# EAGLE design XBee-Explorer-DongleMini-v14 (EAGLE 6.2)
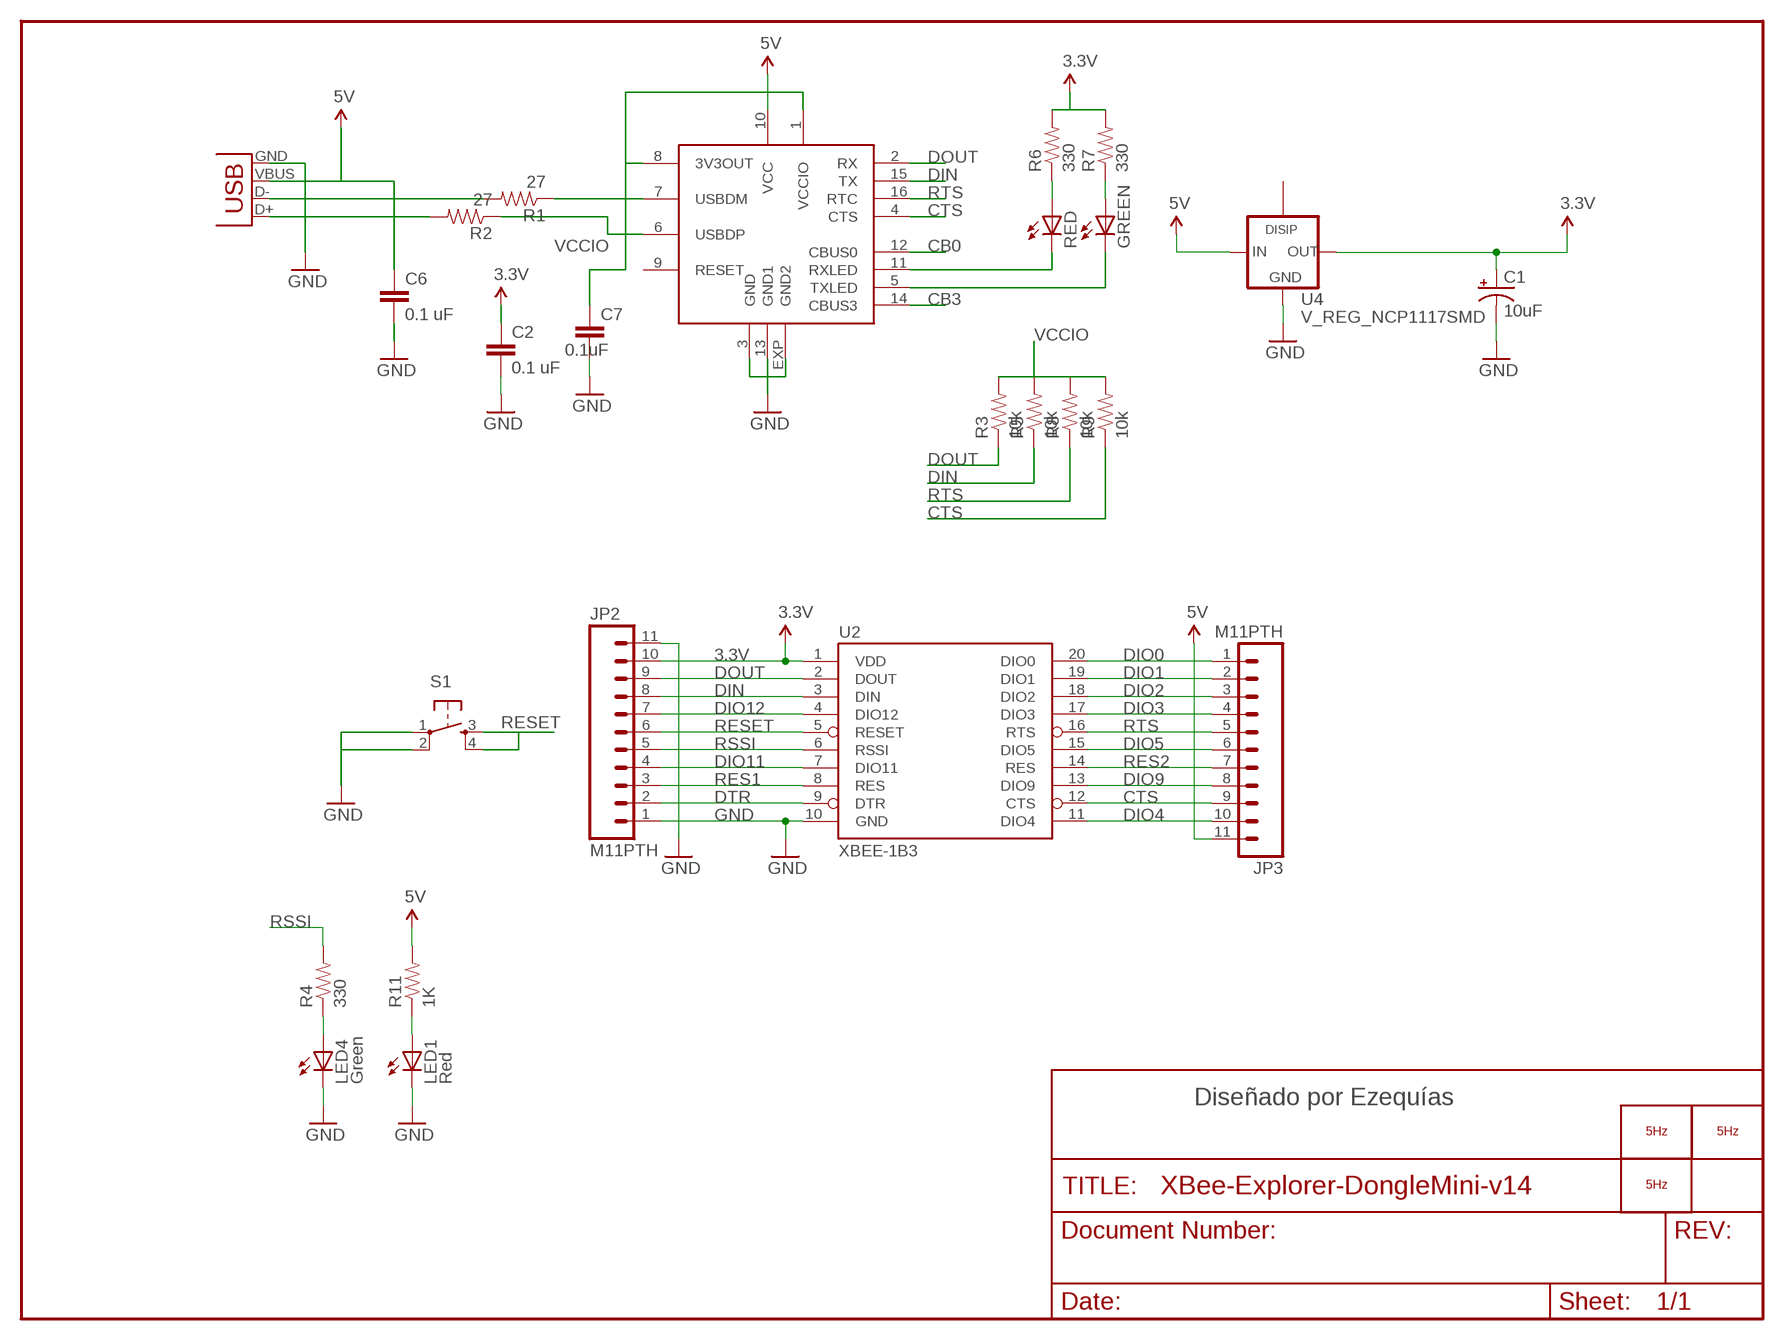
[diagram p0: schematic, sheet 1]

## Parts
C1  10uF  CAP_POL1206  [EIA3216]
C2  0.1 uF  CAP0603-CAP  [0603-CAP]
C6  0.1 uF  CAP0603-CAP  [0603-CAP]
C7  0.1uF  CAP0603-CAP  [0603-CAP]
GREEN  LED0603  [LED-0603]
JP2  M11PTH  [1X11]
JP3  M11PTH  [1X11]
LED1  Red  LED0603  [LED-0603]
LED4  Green  LED0603  [LED-0603]
LOGO2  LOGO_5HZ_H_10MM  [5HZ_LOGO_H_10MM]
LOGO3  LOGO_5HZ_H_COOPER_15MM  [5HZ_LOGO_H_COOPER_15MM]
LOGO4  LOGO_5HZ_WEB_COOPER_10MM  [5HZ_WEB_COOPER_10MM]
R1  27  RESISTOR0603-RES  [0603-RES]
R2  27  RESISTOR0603-RES  [0603-RES]
R3  10k  RESISTOR0603-RES  [0603-RES]
R4  330  RESISTOR0603-RES  [0603-RES]
R5  10k  RESISTOR0603-RES  [0603-RES]
R6  330  RESISTOR0603-RES  [0603-RES]
R7  330  RESISTOR0603-RES  [0603-RES]
R8  10k  RESISTOR0603-RES  [0603-RES]
R9  10k  RESISTOR0603-RES  [0603-RES]
R11  1K  RESISTOR0603-RES  [0603-RES]
RED  LED0603  [LED-0603]
S1  TAC_SWITCHSMD  [TACTILE_SWITCH_SMD]
U2  XBEE-1B3  [XBEE-SMD]
U4  V_REG_NCP1117SMD  [SOT223]
U$5  FT230  [QFN-16]
X1  USBSMD  [USB-MINIB]

## Nets
3.3V [vcc]: C1.A(+) C2.1 JP2.10 R6.2 R7.2 U2.1(VDD) U4.2(OUT)
5V [vcc]: C6.1 JP3.11 R11.2 U4.3(IN) U$5.10(VCC) X1.VBUS
CB0: U$5.12(CBUS0)
CB3: U$5.14(CBUS3)
CTS: JP3.9 R9.1 U2.12(CTS) U$5.4(CTS)
DIN: JP2.8 R5.1 U2.3(DIN) U$5.15(TX)
DIO0: JP3.1 U2.20(DIO0)
DIO1: JP3.2 U2.19(DIO1)
DIO2: JP3.3 U2.18(DIO2)
DIO3: JP3.4 U2.17(DIO3)
DIO4: JP3.10 U2.11(DIO4)
DIO5: JP3.6 U2.15(DIO5)
DIO9: JP3.8 U2.13(DIO9)
DIO11: JP2.4 U2.7(DIO11)
DIO12: JP2.7 U2.4(DIO12)
DOUT: JP2.9 R3.1 U2.2(DOUT) U$5.2(RX)
DTR: JP2.2 U2.9(DTR)
GND [vcc]: C1.C(-) C2.2 C6.2 C7.2 JP2.1 JP2.11 LED1.C LED4.C S1.1 S1.2 U2.10(GND) U4.1(GND) U$5.3(GND) U$5.13(GND1) U$5.EXP(GND2) X1.GND
N$1: R2.1 U$5.6(USBDP)
N$2: LED4.A R4.1
N$3: R1.1 U$5.7(USBDM)
N$5: R1.2 X1.D-
N$6: R2.2 X1.D+
N$8: GREEN.A R7.1
N$9: R6.1 RED.A
N$10: RED.C U$5.11(RXLED)
N$11: GREEN.C U$5.5(TXLED)
N$38: LED1.A R11.1
RES1: JP2.3 U2.8(RES)
RES2: JP3.7 U2.14(RES)
RESET: JP2.6 S1.3 S1.4 U2.5(RESET)
RSSI: JP2.5 R4.2 U2.6(RSSI)
RTS: JP3.5 R8.1 U2.16(RTS) U$5.16(RTC)
VCCIO: C7.1 R3.2 R5.2 R8.2 R9.2 U$5.1(VCCIO) U$5.8(3V3OUT)
Unconnected: U4.4 U$5.9(RESET)

## Notes on the sheet
- Diseñado por Ezequías

## Library data of the parts
C1 = SparkFun:CAP_POL: Capacitor Polarized These are standard SMD and PTH capacitors. Normally 10uF, 47uF, and 100uF in electrolytic and tantalum varieties. Always verify the external diameter of the through hole cap, it varies with capacity, voltage, and manufacturer. The EIA devices should be standard.
C2 C6 C7 = SparkFun:CAP: Capacitor Standard 0603 ceramic capacitor, and 0.1" leaded capacitor.
GREEN LED1 LED4 RED = SparkFun:LED: LEDs Standard schematic elements and footprints for 5mm, 3mm, 1206, and 0603 sized LEDs. 5mm - Spark Fun Electronics SKU : COM-00529 (and others)
JP2 JP3 = SparkFun:M11: Header 11 Standard 11-pin 0.1" header. Use with straight break away headers (SKU : PRT-00116), right angle break away headers (PRT-00553), swiss pins (PRT-00743), machine pins (PRT-00117), and female headers (PRT-00115).
LOGO2-LOGO4 = 5hz-electronica:LOGO_5HZ: Logotipo 5Hz "según Pedro"
R1-R9 R11 = SparkFun:RESISTOR: Resistor Basic schematic elements and footprints for 0603, 1206, and PTH resistors.
S1 = SparkFun:TAC_SWITCH: Momentary Switch Button commonly used for reset or general input. Spark Fun Electronics SKU : COM-00097
U2 = SparkFun:XBEE-1
U4 = 5hz-electronica:V_REG_NCP1117: Voltage Regulator The NCP1117 series are low dropout positive voltage regulators that are capable of providing an output current that is in excess of 1.0 A with a maximum dropout voltage of 1.2 V at 800 mA over temperature. This series contains eight fixed output voltages of 1.5 V, 1.8 V, 2.0 V, 2.5 V, 2.85 V, 3.3 V, 5.0 V, and 12 V that have no minimum load requirement to maintain regulation. Also included is an adjustable output version that can be programmed from 1.25 V to 18.8 V with two external resistors. On chip trimming adjusts the reference/output voltage to within ±1.0% accuracy. Internal protection features consist of output current limiting, safe operating area compensation, and thermal shutdown. The NCP1117 series can operate with up to 20 V input. Devices are available in SOT-223 and DPAK packages.
U$5 = FT230:FT230
X1 = SparkFun:USB: USB Connectors USB-B-PTH is fully proven SKU : PRT-00139 USB-miniB is fully proven SKU : PRT-00587 USB-A-PCB is untested. USB-A-H is throughly reviewed, but untested. Spark Fun Electronics SKU : PRT-00437 USB-B-SMT is throughly reviewed, but untested. Needs silkscreen touching up. USB-A-S has not been used/tested USB-MB-H has not been used/tested

## Net classes
1 vcc: width 0.254 mm
2 gnd: width 0.254 mm

## Board
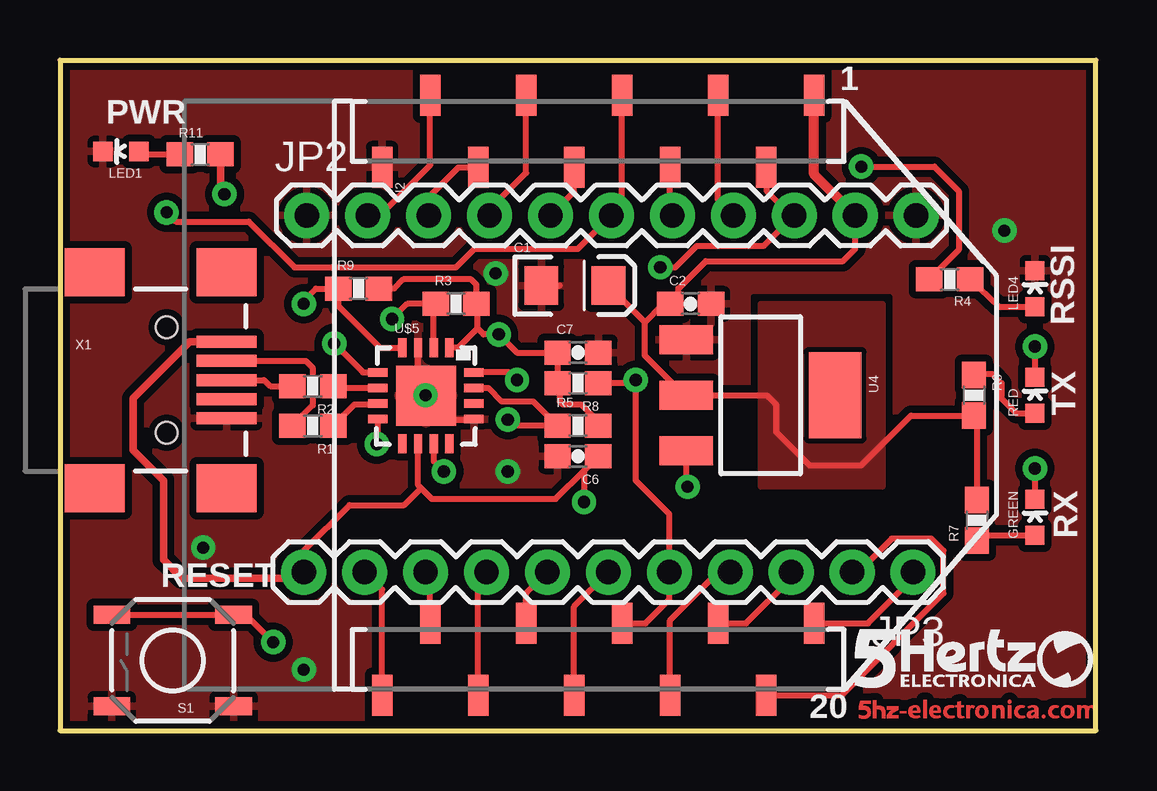
[diagram p1: board, top side]
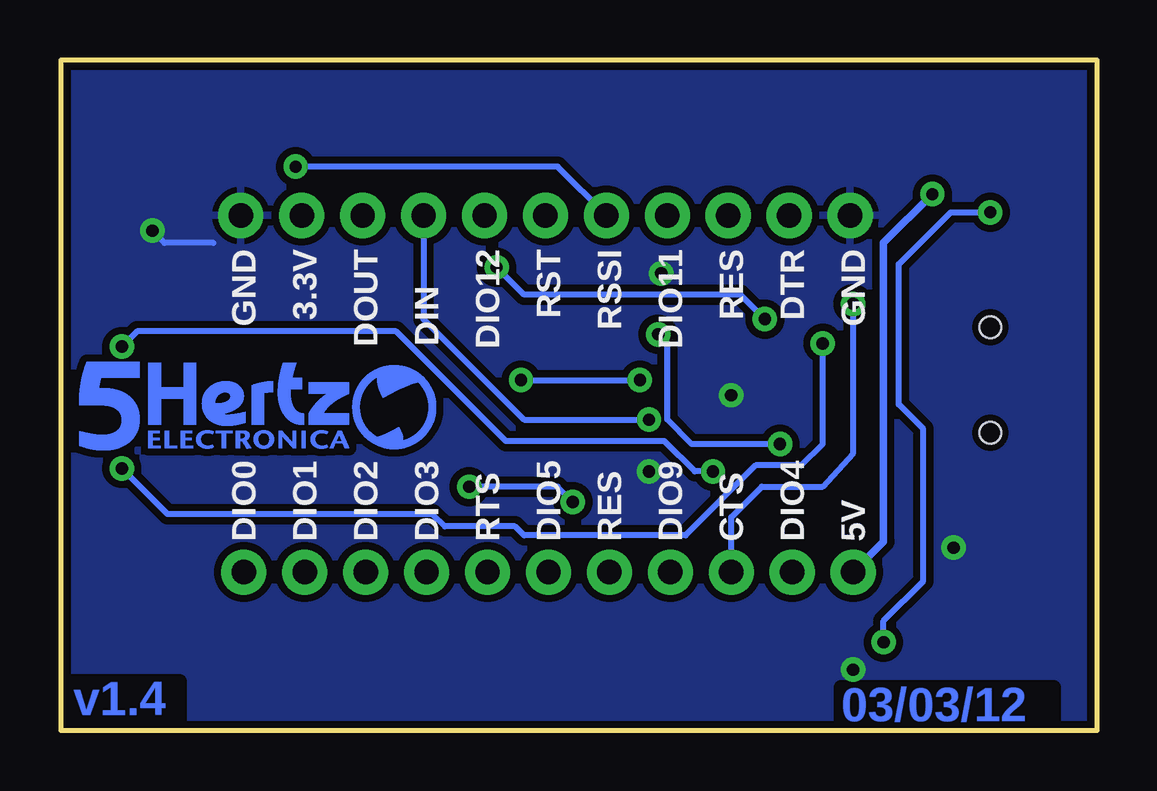
[diagram p2: board, bottom side, seen from below]

Size 43.18 x 27.94 mm. Coordinates in mm from the lower left corner, seen from the top.
Outline: 43.18,0 43.18,27.94 0,27.94 0,0 43.18,0
Copper layers (1*16): Top 0.035mm / dielectric 1.5mm / Bottom 0.035mm
Design rules: minimum track width 8mil, minimum drill 20mil, track to track 8mil, track to pad 8mil, pad to pad 8mil, via to via 8mil, smd to smd 8mil, copper to edge 10mil, drill to drill 8mil, minimum pad ring 12mil, minimum via ring 10mil, stop-mask expansion 4mil, vias tented up to drill 25mil, thermal gap 10mil

### Footprints (pad centres in the part's own frame; a part is rotated, then mirrored left to right if it is on the bottom)
EIA3216 = smd 1.4 x 1.6: A 1.4,0; C -1.4,0
0603-CAP = smd 1.1 x 1: 1 -0.85,0; 2 0.85,0
LED-0603 = smd 0.8 x 0.8: A 0,-0.75; C 0,0.75
1X11 = drill 1.016 pad 1.88: 1 0,0; 2 2.54,0; 3 5.08,0; 4 7.62,0; 5 10.16,0; 6 12.7,0; 7 15.24,0; 8 17.78,0; 9 20.32,0; 10 22.86,0; 11 25.4,0
0603-RES = smd 1.1 x 1: 1 -0.85,0; 2 0.85,0
TACTILE_SWITCH_SMD = smd 1.524 x 0.762: 1 -2.54,1.905; 2 2.54,1.905; 3 -2.54,-1.905; 4 2.54,-1.905
XBEE-SMD = smd 1.7 x 0.85: 1 -12.5,20; 2 -9.5,18; 3 -12.5,16; 4 -9.5,14; 5 -12.5,12; 6 -9.5,10; 7 -12.5,8; 8 -9.5,6; 9 -12.5,4; 10 -9.5,2; 11 12.5,2; 12 9.5,4; 13 12.5,6; 14 9.5,8; 15 12.5,10; 16 9.5,12; 17 12.5,14; 18 9.5,16; 19 12.5,18; 20 9.5,20
SOT223 = smd 1.219 x 2.235: 1 -2.311,-3.099; 2 0,-3.099; 3 2.311,-3.099 | smd 3.6 x 2.2: 4 0,3.099
QFN-16 = smd 0.8 x 0.35: 1 1.981,-0.989; 2 1.981,-0.339; 3 1.981,0.311; 4 1.981,0.961; 9 -2.019,0.961; 10 -2.019,0.311; 11 -2.019,-0.339; 12 -2.019,-0.989 | smd 0.35 x 0.8: 5 0.956,1.986; 6 0.306,1.986; 7 -0.344,1.986; 8 -0.994,1.986; 13 -0.994,-2.014; 14 -0.344,-2.014; 15 0.306,-2.014; 16 0.956,-2.014 | smd 2.5 x 2.5: EXP -0.019,-0.014
USB-MINIB = smd 2.5 x 0.5: D+ 2.5,0; D- 2.5,0.8; GND 2.5,-1.6; ID 2.5,-0.8; VBUS 2.5,1.6 | smd 2.5 x 2: MTN1 -3,4.5; MTN2 2.5,4.5; MTN3 -3,-4.5; MTN4 2.5,-4.5 | hole 0.9: 0,2.2; 0,-2.2

### Placement (x,y rotation side)
C1  21.46,18.54 0 top
C2  26.29,17.78 0 top
C6  21.59,11.43 180 top
C7  21.59,15.75 0 top
GREEN  40.64,8.89 0 top
JP2  10.29,21.46 0 top
JP3  35.56,6.6 180 top
LED1  2.54,24.13 90 top
LED4  40.64,18.41 0 top
LOGO2  33.15,1.78 0 top
LOGO3  42.42,11.68 0 bottom
LOGO4  33.27,0.51 0 top
R1  10.54,12.7 180 top
R2  10.54,14.35 180 top
R3  16.51,17.78 0 top
R4  37.08,18.8 180 top
R5  21.59,12.7 0 top
R6  38.1,13.97 270 top
R7  38.23,8.76 90 top
R8  21.59,14.48 180 top
R9  12.45,18.41 0 top
R11  5.84,24 0 top
RED  40.64,13.97 0 top
S1  4.7,2.92 180 top
U2  11.43,13.97 270 top
U4  29.21,13.97 270 top
U$5  15.24,13.97 90 top
X1  4.45,14.61 0 top

### Tracks (layer width: path | path; a pad name or v marks a point on that pad's centre or on a via)
3.3V
  Top 0.254: R7.2 38.23,12.99 R6.2 35.47,13.12 33.4,11.05 31.24,11.05 29.84,12.45 29.84,13.59 29.46,13.97 U4.2 26.04,13.97 24.38,15.62 24.38,17.02 | 24.38,17.02 C1.A | JP2.10 33.15,20.07 32.64,19.56 26.92,19.56 25.78,18.41 25.78,17.82 C2.1 25.14,17.78 24.38,17.02
  Top 0.406: U2.1 31.43,23.18 JP2.10
  pour Top: 29.21,17.78 34.29,17.78 34.29,10.16 29.21,10.16
5V  (via drill 0.51)
  Top 0.254: v6.86,22.35 6.69,22.52 | U$5.10 14.93,10.22 15.05,10.1 | 15.05,10.1 15.49,9.65 20.66,9.65 21.84,10.83 | U4.3 26.11,10.21 v26.16,10.16 | 21.84,10.83 v21.84,9.53 | 21.84,10.83 C6.1 | 15.05,10.1 14.35,9.4 12.06,9.4 10.16,7.49 JP3.11 9.91,6.35 | X1.VBUS 7.82,16.2
  Top 0.305: 6.69,22.52 R11.2 | X1.VBUS 5.41,16.2 3.05,13.84 3.05,11.68 4.32,10.41 4.32,7.11 5.08,6.35 9.91,6.35
  Bottom 0.254: v26.16,10.16 22.48,10.16 v21.84,9.53
  Bottom 0.305: v6.86,22.35 8.89,20.32 8.89,7.87 JP3.11
CTS  (via drill 0.51)
  Top 0.254: U2.12 15.43,6.41 JP3.9 | U$5.4 13.34,15.95 11.6,17.69 R9.1 10.67,18.41 10.16,17.91 v10.16,17.78
  Bottom 0.254: JP3.9 15.24,8.89 13.97,10.16 11.43,10.16 10.16,11.56 v10.16,17.78
DIN  (via drill 0.51)
  Top 0.254: U2.3 27.43,22.1 JP2.8 | U$5.15 17.86,14.28 18.41,13.72 19.72,13.72 R5.1 18.92,12.7 v18.67,12.95
  Bottom 0.254: JP2.8 28.07,17.14 23.88,12.95 v18.67,12.95
DIO0
  Top 0.254: U2.20 33.68,4.47 35.56,6.35 JP3.1
DIO1
  Top 0.254: U2.19 32.59,1.47 36.83,5.71 36.83,7.49 36.32,8 34.67,8 33.27,6.6 JP3.2
DIO2
  Top 0.254: U2.18 28.6,4.47 30.48,6.35 JP3.3
DIO3
  Top 0.254: U2.17 25.43,4.6 27.43,6.6 JP3.4
DIO4
  Top 0.254: U2.11 13.43,5.87 JP3.10
DIO5
  Top 0.254: U2.15 21.43,5.17 JP3.6
DIO9
  Top 0.254: U2.13 17.43,6.25 JP3.8
DIO11
  Top 0.254: U2.7 19.43,23.24 17.91,21.72 JP2.4
DIO12
  Top 0.254: U2.4 25.43,21.62 JP2.7
DOUT  (via drill 0.51)
  Top 0.254: U2.2 29.46,23.44 29.46,22.48 30.48,21.46 JP2.9 29.34,20.19 26.54,20.19 25.65,19.3 v25.02,19.3 | R3.1 15.24,17.78 | U$5.2 15.58,17.7 R3.1 | R3.1 14.48,17.78 v13.84,17.14
  Bottom 0.254: v13.84,17.14 14.86,18.16 23.88,18.16 v25.02,19.3
DTR
  Top 0.254: U2.9 15.43,23.56 13.34,21.46 JP2.2
GND  (via drill 0.51)
  Top 0.254: U$5.3 14.93,14.28 U$5.EXP 15.39,13.95 16.38,12.95 17.23,12.95 U$5.13 | C1.C 20.83,18.54
  Bottom 0.254: v39.37,20.83 38.86,20.32 36.83,20.32
  other vias: 5.97,7.62 15.24,13.97 18.67,10.79 18.16,19.05 10.16,2.54
  pour Bottom (isolate 0.305): 0,27.94 43.18,27.94 43.18,0 0,0
  pour Top (isolate 0.305, rank 2): 0,27.94 43.18,27.94 43.18,0 0,0
N$1
  Top 0.254: 11.47,14.28 U$5.6
  Top 0.305: R2.1 11.47,14.28
N$2
  Top 0.254: R4.1 39.13,17.65 LED4.A
N$3
  Top 0.254: U$5.7 13.22,13.59 12.28,13.59 R1.1
N$5
  Top 0.254: X1.D- 10.25,15.4 10.54,15.11 10.54,13.55 R1.2
N$6
  Top 0.254: R2.2 8.76,14.35 8.51,14.61 X1.D+
N$8
  Top 0.254: GREEN.A 38.45,8.14 R7.1
N$9
  Top 0.254: RED.A 39.87,13.22 39.24,13.84 39.24,14.48 38.86,14.86 38.14,14.86 R6.1
N$10  (via drill 0.51)
  Top 0.254: U$5.11 15.58,11.22 v16,10.79 | v40.64,16 RED.C
  Bottom 0.254: v16,10.79 16.76,10.79 18.03,12.06 24.64,12.06 29.21,16.64 40.01,16.64 v40.64,16
N$11  (via drill 0.51)
  Top 0.254: U$5.5 12.63,14.93 v11.43,16.13 | v40.64,10.92 GREEN.C
  Bottom 0.254: v11.43,16.13 11.43,11.94 12.32,11.05 14.22,11.05 17.14,8.13 23.88,8.13 24.26,8.51 27.18,8.51 27.69,9.02 38.73,9.02 v40.64,10.92
N$38
  Top 0.254: R11.1 3.42,24 LED1.A
RES1
  Top 0.254: U2.8 16.61,23.47 15.37,22.23 JP2.3
RES2
  Top 0.254: U2.14 19.43,5.71 JP3.7
RESET  (via drill 0.51)
  Top 0.254: U2.5 23.43,22.16 JP2.6 21.59,20.07 17.27,20.07 16.51,19.3 9.78,19.3 7.87,21.21 4.83,21.21 v4.45,21.59 | S1.4 S1.3 7.75,4.83 v8.89,3.68
  Bottom 0.254: v8.89,3.68 8.89,4.57 7.24,6.22 7.24,12.57 8.26,13.59 8.26,19.43 6.1,21.59 v4.45,21.59
RSSI  (via drill 0.51)
  Top 0.254: U2.6 21.43,22.45 JP2.5 | v33.4,23.5 36.45,23.5 37.47,22.48 37.47,20.03 R4.2
  Bottom 0.254: v33.4,23.5 22.48,23.5 JP2.5
RTS  (via drill 0.51)
  Top 0.254: U2.16 24.41,4.47 25.4,5.46 JP3.5 25.4,9.02 24,10.41 v24,14.61 23.88,14.48 R8.1 | U$5.16 18.73,14.93 v19.05,14.61
  Bottom 0.254: v24,14.61 v19.05,14.61
VCCIO  (via drill 0.51)
  Top 0.254: U$5.1 16.59,15.95 17.4,16.76 | 17.4,16.76 17.4,17.74 R3.2 17.36,18.58 17.14,18.8 14.31,18.8 13.93,18.41 R9.2 | U$5.8 13.25,11.98 v13.21,11.94 | 17.4,16.76 17.65,16.51 v18.29,16.51 19.05,15.75 C7.1 R8.2 20.83,14.39 20.83,13.72 20.95,13.59 21.72,13.59 22.44,12.87 R5.2
  Bottom 0.254: v13.21,11.94 16.89,11.94 17.91,12.95 17.91,16.13 v18.29,16.51

### Text on the board
Bottom: v1.4 | 03/03/12
tPlace: 1 | PWR | RSSI | TX | RX | RESET | 20
bPlace: GND | DTR | RES | DIO11 | RSSI | RST | DIO12 | DOUT | 3.3V | GND | DIN | 5V | DIO4 | CTS | DIO9 | RES | DIO5 | RTS | DIO3 | DIO2 | DIO1 | DIO0
tValues: XBee Socket Up | DNP | DNP | XBee Socket Up